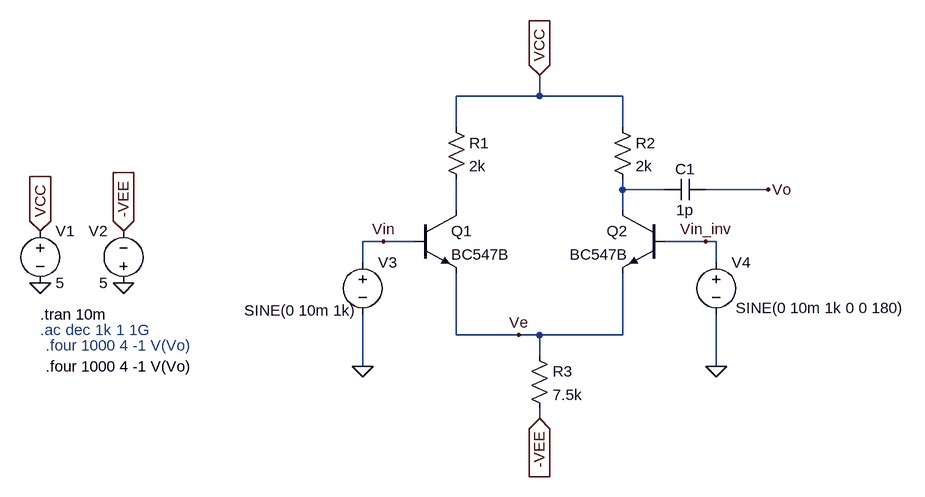
[diagram p0: schematic preAmpFinal2.asc]
preAmpFinal2.asc, the LTspice schematic file:
Version 4
SHEET 1 1072 680
WIRE 496 -64 496 -96
WIRE 496 -64 368 -64
WIRE 624 -64 496 -64
WIRE 368 -16 368 -64
WIRE 624 -16 624 -64
WIRE 624 80 624 64
WIRE 688 80 624 80
WIRE 848 80 752 80
WIRE 368 112 368 64
WIRE 624 112 624 80
WIRE 256 160 224 160
WIRE 304 160 256 160
WIRE 752 160 688 160
WIRE 768 160 752 160
WIRE 224 192 224 160
WIRE 768 192 768 160
WIRE 368 304 368 208
WIRE 464 304 368 304
WIRE 496 304 464 304
WIRE 624 304 624 208
WIRE 624 304 496 304
WIRE 496 336 496 304
WIRE 224 352 224 272
WIRE 768 352 768 272
WIRE 496 432 496 416
FLAG 224 352 0
FLAG 768 352 0
FLAG 256 160 Vin
FLAG 752 160 Vin_inv
FLAG 464 304 Ve
FLAG -144 224 0
FLAG -272 224 0
FLAG -272 144 VCC
IOPIN -272 144 In
FLAG -144 144 -VEE
IOPIN -144 144 In
FLAG 496 432 -VEE
IOPIN 496 432 In
FLAG 496 -96 VCC
IOPIN 496 -96 In
FLAG 848 80 Vo
SYMBOL res 352 -32 R0
SYMATTR InstName R1
SYMATTR Value 2k
SYMBOL res 608 -32 R0
SYMATTR InstName R2
SYMATTR Value 2k
SYMBOL npn 304 112 R0
SYMATTR InstName Q1
SYMATTR Value BC547B
SYMBOL npn 688 112 M0
SYMATTR InstName Q2
SYMATTR Value BC547B
SYMBOL res 480 320 R0
SYMATTR InstName R3
SYMATTR Value 7.5k
SYMBOL voltage -272 128 R0
SYMATTR InstName V1
SYMATTR Value 5
SYMBOL voltage -144 240 R180
WINDOW 0 24 96 Left 2
WINDOW 3 24 16 Left 2
SYMATTR InstName V2
SYMATTR Value 5
SYMBOL cap 752 64 R90
WINDOW 0 0 32 VBottom 2
WINDOW 3 32 32 VTop 2
SYMATTR InstName C1
SYMATTR Value 1p
SYMBOL voltage 224 176 R0
WINDOW 123 -182 114 Left 2
WINDOW 39 0 0 Left 0
WINDOW 3 -182 90 Left 2
SYMATTR Value SINE(0 10m 1k)
SYMATTR InstName V3
SYMBOL voltage 768 176 R0
WINDOW 123 30 110 Left 2
WINDOW 39 0 0 Left 0
WINDOW 3 30 86 Left 2
SYMATTR Value SINE(0 10m 1k 0 0 180)
SYMATTR InstName V4
TEXT -272 272 Left 2 !.tran 10m
TEXT -272 296 Left 2 ;.ac dec 1k 1 1G
TEXT -264 320 Left 2 ;.four 1000 4 -1 V(Vo)
TEXT -264 352 Left 2 !.four 1000 4 -1 V(Vo)

The netlist it stands for:
* preAmpFinal2.asc
R1 VCC N002 2k
R2 VCC N001 2k
Q1 N002 Vin Ve 0 BC547B
Q2 N001 Vin_inv Ve 0 BC547B
R3 Ve -VEE 7.5k
V1 VCC 0 5
V2 0 -VEE 5
C1 Vo N001 1p
V3 Vin 0 SINE(0 10m 1k)
V4 Vin_inv 0 SINE(0 10m 1k 0 0 180)
.model NPN NPN
.model PNP PNP
.lib standard.bjt
.tran 10m
* .ac dec 1k 1 1G
* .four 1000 4 -1 V(Vo)
.four 1000 4 -1 V(Vo)
.backanno
.end